# EAGLE design webcam_with_pan_tilt (EAGLE 9.2.2)
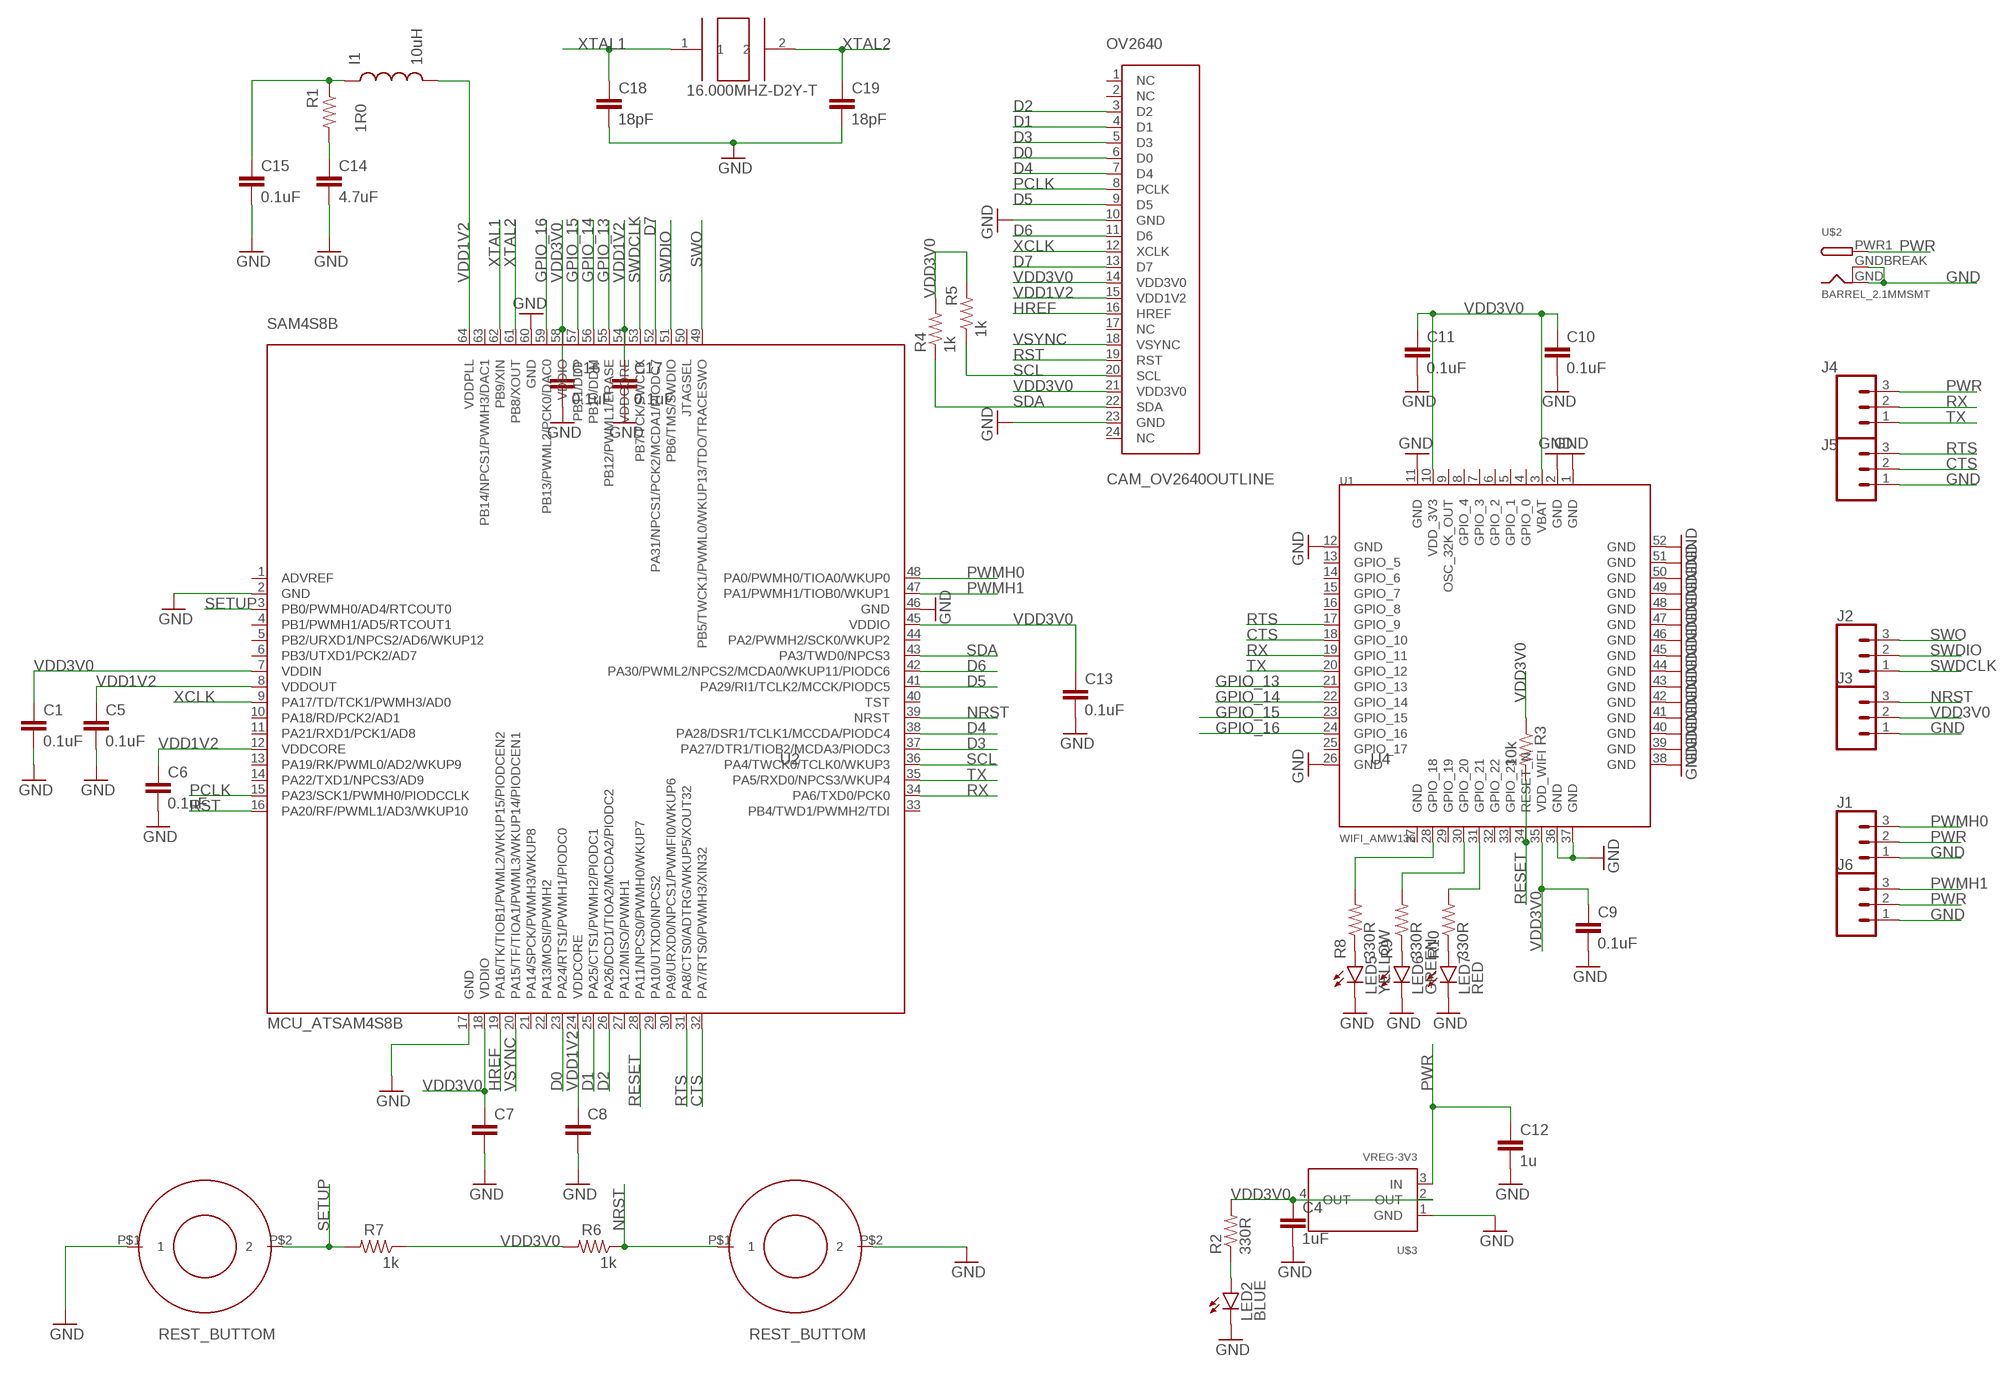
[diagram p0: schematic, sheet 1]

## Parts
16.000MHZ-D2Y-T  XTAL_12MHZ  [ABM7-16.000MHZ-D2Y-T]
C1  0.1uF  CAP  [0805]
C4  1uF  CAP  [0805]
C5  0.1uF  CAP  [0805]
C6  0.1uF  CAP  [0805]
C7  CAP  [0805]
C8  CAP  [0805]
C9  0.1uF  CAP  [0805]
C10  0.1uF  CAP  [0805]
C11  0.1uF  CAP  [0805]
C12  1u  CAP  [0805]
C13  0.1uF  CAP  [0805]
C14  4.7uF  CAP  [0805]
C15  0.1uF  CAP  [0805]
C16  0.1uF  CAP  [0805]
C17  0.1uF  CAP  [0805]
C18  18pF  CAP  [0805]
C19  18pF  CAP  [0805]
I1  10uH  IND  [0805]
J1  CONN_03  [1X03]
J2  CONN_03  [1X03]
J3  CONN_03  [1X03]
J4  CONN_03  [1X03]
J5  CONN_03  [1X03]
J6  CONN_03  [1X03]
LED2  BLUE  LED0603  [LED-0603]
LED5  YELLOW  LED0603  [LED-0603]
LED6  GREEN  LED0603  [LED-0603]
LED7  RED  LED0603  [LED-0603]
OV2640  CAM_OV2640OUTLINE  [CAM_CONN]
R1  1R0  RES  [0805]
R2  330R  RES  [0805]
R3  10k  RES  [0805]
R4  1k  RES  [0805]
R5  1k  RES  [0805]
R6  1k  RES  [0805]
R7  1k  RES  [0805]
R8  330R  RES  [0805]
R9  330R  RES  [0805]
R10  330R  RES  [0805]
SAM4S8B  MCU_ATSAM4S8B  [QFP50P1200X1200X160-64N]
U1  WIFI_AMW136  [AMW136]
U2  REST_BUTTOM  SWITCH_BTN_NO  [BTN_2]
U4  REST_BUTTOM  SWITCH_BTN_NO  [BTN_2]
U$2  BARREL_2.1MMSMT  [DCJACK_2MM_SMT]
U$3  VREG-3V3  [R-PDSO-G4_TI]

## Nets
CTS: J5.2 SAM4S8B.32(PA7/RTS0/PWMH3/XIN32) U1.18(GPIO_10)
D0: OV2640.6(D0) SAM4S8B.23(PA24/RTS1/PWMH1/PIODC0)
D1: OV2640.4(D1) SAM4S8B.25(PA25/CTS1/PWMH2/PIODC1)
D2: OV2640.3(D2) SAM4S8B.26(PA26/DCD1/TIOA2/MCDA2/PIODC2)
D3: OV2640.5(D3) SAM4S8B.37(PA27/DTR1/TIOB2/MCDA3/PIODC3)
D4: OV2640.7(D4) SAM4S8B.38(PA28/DSR1/TCLK1/MCCDA/PIODC4)
D5: OV2640.9(D5) SAM4S8B.41(PA29/RI1/TCLK2/MCCK/PIODC5)
D6: OV2640.11(D6) SAM4S8B.42(PA30/PWML2/NPCS2/MCDA0/WKUP11/PIODC6)
D7: OV2640.13(D7) SAM4S8B.52(PA31/NPCS1/PCK2/MCDA1/PIODC7)
GND: C1.2 C4.2 C5.2 C6.2 C7.2 C8.2 C9.2 C10.2 C11.2 C12.2 C13.2 C14.2 C15.2 C16.2 C17.2 C18.2 C19.2 J1.1 J3.1 J5.1 J6.1 LED2.C LED5.C LED6.C LED7.C OV2640.10(GND) OV2640.23(GND) SAM4S8B.2(GND) SAM4S8B.17(GND) SAM4S8B.46(GND) SAM4S8B.60(GND) U1.1(GND) U1.2(GND) U1.11(GND) U1.12(GND) U1.26(GND) U1.36(GND) U1.37(GND) U1.38(GND) U1.39(GND) U1.40(GND) U1.41(GND) U1.42(GND) U1.43(GND) U1.44(GND) U1.45(GND) U1.46(GND) U1.47(GND) U1.48(GND) U1.49(GND) U1.50(GND) U1.51(GND) U1.52(GND) U2.P$1 U4.P$2 U$2.GND U$2.GNDBREAK U$3.1(GND)
GPIO_13: SAM4S8B.55(PB12/PWML1/ERASE) U1.21(GPIO_13)
GPIO_14: SAM4S8B.56(PB10/DDM) U1.22(GPIO_14)
GPIO_15: SAM4S8B.57(PB11/DDP) U1.23(GPIO_15)
GPIO_16: SAM4S8B.59(PB13/PWML2/PCK0/DAC0) U1.24(GPIO_16)
HREF: OV2640.16(HREF) SAM4S8B.19(PA16/TK/TIOB1/PWML2/WKUP15/PIODCEN2)
N$2: C14.1 R1.2
N$3: C15.1 I1.1 R1.1
N$4: LED5.A R8.1
N$5: LED6.A R9.1
N$6: R8.2 U1.28(GPIO_18)
N$7: LED2.A R2.1
N$8: LED7.A R10.1
N$10: R9.2 U1.30(GPIO_20)
N$12: R10.2 U1.31(GPIO_21)
NRST: J3.3 R6.1 SAM4S8B.39(NRST) U4.P$1
PCLK: OV2640.8(PCLK) SAM4S8B.15(PA23/SCK1/PWMH0/PIODCCLK)
PWMH0: J1.3 SAM4S8B.48(PA0/PWMH0/TIOA0/WKUP0)
PWMH1: J6.3 SAM4S8B.47(PA1/PWMH1/TIOB0/WKUP1)
PWR: C12.1 J1.2 J4.3 J6.2 U$2.PWR1(PWR) U$3.3(IN)
RESET: R3.2 SAM4S8B.28(PA11/NPCS0/PWMH0/WKUP7) U1.34(RESET_N)
RST: OV2640.19(RST) SAM4S8B.16(PA20/RF/PWML1/AD3/WKUP10)
RTS: J5.3 SAM4S8B.31(PA8/CTS0/ADTRG/WKUP5/XOUT32) U1.17(GPIO_9)
RX: J4.2 SAM4S8B.34(PA6/TXD0/PCK0) U1.19(GPIO_11)
SCL: OV2640.20(SCL) R5.1 SAM4S8B.36(PA4/TWCK0/TCLK0/WKUP3)
SDA: OV2640.22(SDA) R4.1 SAM4S8B.43(PA3/TWD0/NPCS3)
SETUP: R7.2 SAM4S8B.3(PB0/PWMH0/AD4/RTCOUT0) U2.P$2
SWDCLK: J2.1 SAM4S8B.53(PB7/TCK/SWCLK)
SWDIO: J2.2 SAM4S8B.51(PB6/TMS/SWDIO)
SWO: J2.3 SAM4S8B.49(PB5/TWCK1/PWML0/WKUP13/TDO/TRACESWO)
TX: J4.1 SAM4S8B.35(PA5/RXD0/NPCS3/WKUP4) U1.20(GPIO_12)
VDD1V2: C5.1 C6.1 C8.1 C17.1 I1.2 OV2640.15(VDD1V2) SAM4S8B.8(VDDOUT) SAM4S8B.12(VDDCORE) SAM4S8B.24(VDDCORE) SAM4S8B.54(VDDCORE) SAM4S8B.64(VDDPLL)
VDD3V0: C1.1 C4.1 C7.1 C9.1 C10.1 C11.1 C13.1 C16.1 J3.2 OV2640.14(VDD3V0) OV2640.21(VDD3V0) R2.2 R3.1 R4.2 R5.2 R6.2 R7.1 SAM4S8B.7(VDDIN) SAM4S8B.18(VDDIO) SAM4S8B.45(VDDIO) SAM4S8B.58(VDDIO) U1.3(VBAT) U1.10(VDD_3V3) U1.35(VDD_WIFI) U$3.2(OUT) U$3.4(OUT)
VSYNC: OV2640.18(VSYNC) SAM4S8B.20(PA15/TF/TIOA1/PWML3/WKUP14/PIODCEN1)
XCLK: OV2640.12(XCLK) SAM4S8B.9(PA17/TD/TCK1/PWMH3/AD0)
XTAL1: 16.000MHZ-D2Y-T.1 C18.1 SAM4S8B.62(PB9/XIN)
XTAL2: 16.000MHZ-D2Y-T.2 C19.1 SAM4S8B.61(PB8/XOUT)
Unconnected: OV2640.1(NC) OV2640.2(NC) OV2640.17(NC) OV2640.24(NC) SAM4S8B.1(ADVREF) SAM4S8B.4(PB1/PWMH1/AD5/RTCOUT1) SAM4S8B.5(PB2/URXD1/NPCS2/AD6/WKUP12) SAM4S8B.6(PB3/UTXD1/PCK2/AD7) SAM4S8B.10(PA18/RD/PCK2/AD1) SAM4S8B.11(PA21/RXD1/PCK1/AD8) SAM4S8B.13(PA19/RK/PWML0/AD2/WKUP9) SAM4S8B.14(PA22/TXD1/NPCS3/AD9) SAM4S8B.21(PA14/SPCK/PWMH3/WKUP8) SAM4S8B.22(PA13/MOSI/PWMH2) SAM4S8B.27(PA12/MISO/PWMH1) SAM4S8B.29(PA10/UTXD0/NPCS2) SAM4S8B.30(PA9/URXD0/NPCS1/PWMFI0/WKUP6) SAM4S8B.33(PB4/TWD1/PWMH2/TDI) SAM4S8B.40(TST) SAM4S8B.44(PA2/PWMH2/SCK0/WKUP2) SAM4S8B.50(JTAGSEL) SAM4S8B.63(PB14/NPCS1/PWMH3/DAC1) U1.4(GPIO_0) U1.5(GPIO_1) U1.6(GPIO_2) U1.7(GPIO_3) U1.8(GPIO_4) U1.9(OSC_32K_OUT) U1.13(GPIO_5) U1.14(GPIO_6) U1.15(GPIO_7) U1.16(GPIO_8) U1.25(GPIO_17) U1.27(GND) U1.29(GPIO_19) U1.32(GPIO_22) U1.33(GPIO_23)

## Library data of the parts
16.000MHZ-D2Y-T = Ilya_Teach:XTAL_12MHZ
C1 C4-C19 = Ilya_Teach:CAP
I1 = Ilya_Teach:IND
J1-J6 = SparkFun-Connectors:CONN_03: Multi connection point. Often used as Generic Header-pin footprint for 0.1 inch spaced/style header connections On any of the 0.1 inch spaced packages, you can populate with these: Break Away Headers - Straight <https://www.sparkfun.com/products/116> (PRT-00116) Break Away Male Headers - Right Angle <https://www.sparkfun.com/products/553> (PRT-00553) Female Headers <https://www.sparkfun.com/products/115> (PRT-00115) Break Away Headers - Machine Pin <https://www.sparkfun.com/products/117> (PRT-00117) Break Away Female Headers - Swiss Machine Pin <https://www.sparkfun.com/products/743> (PRT-00743) Stackable Header - 3 Pin (Female, 0.1") <https://www.sparkfun.com/products/13875> (PRT-13875) For SCREWTERMINALS and SPRING TERMINALS visit here: Screw Terimnals on SparkFun.com <https://www.sparkfun.com/search/results?term=Screw+Terminals> (5mm/3.5mm/2.54mm spacing) This device is also useful as a general connection point to wire up your design to another part of your project. Our various solder wires solder well into these plated through hole pads. Hook-Up Wire - Assortment (Stranded, 22 AWG) <https://www.sparkfun.com/products/11375> (PRT-11375) Hook-Up Wire - Assortment (Solid Core, 22 AWG) <https://www.sparkfun.com/products/11367> (PRT-11367) View the entire wire category on our website here <https://www.sparkfun.com/categories/141> Special notes: Molex polarized connector foot print use with SKU : PRT-08232 with associated crimp pins and housings.
LED2 LED5-LED7 = Ilya_Teach:LED: LEDs Standard schematic elements and footprints for 5mm, 3mm, 1206, and 0603 sized LEDs. 5mm - Spark Fun Electronics SKU : COM-00529 (and others)
OV2640 = Ilya_Teach:CAM_OV2640
R1-R10 = Ilya_Teach:RES
SAM4S8B = Ilya_Teach:MCU_ATSAM4S8B
U1 = Ilya_Teach:WIFI_AMW136
U2 U4 = Ilya_Teach:SWITCH_BTN_NO
U$2 = Ilya_Teach:BARREL_2.1MM
U$3 = Ilya_Teach:VREG-3V3

## Board
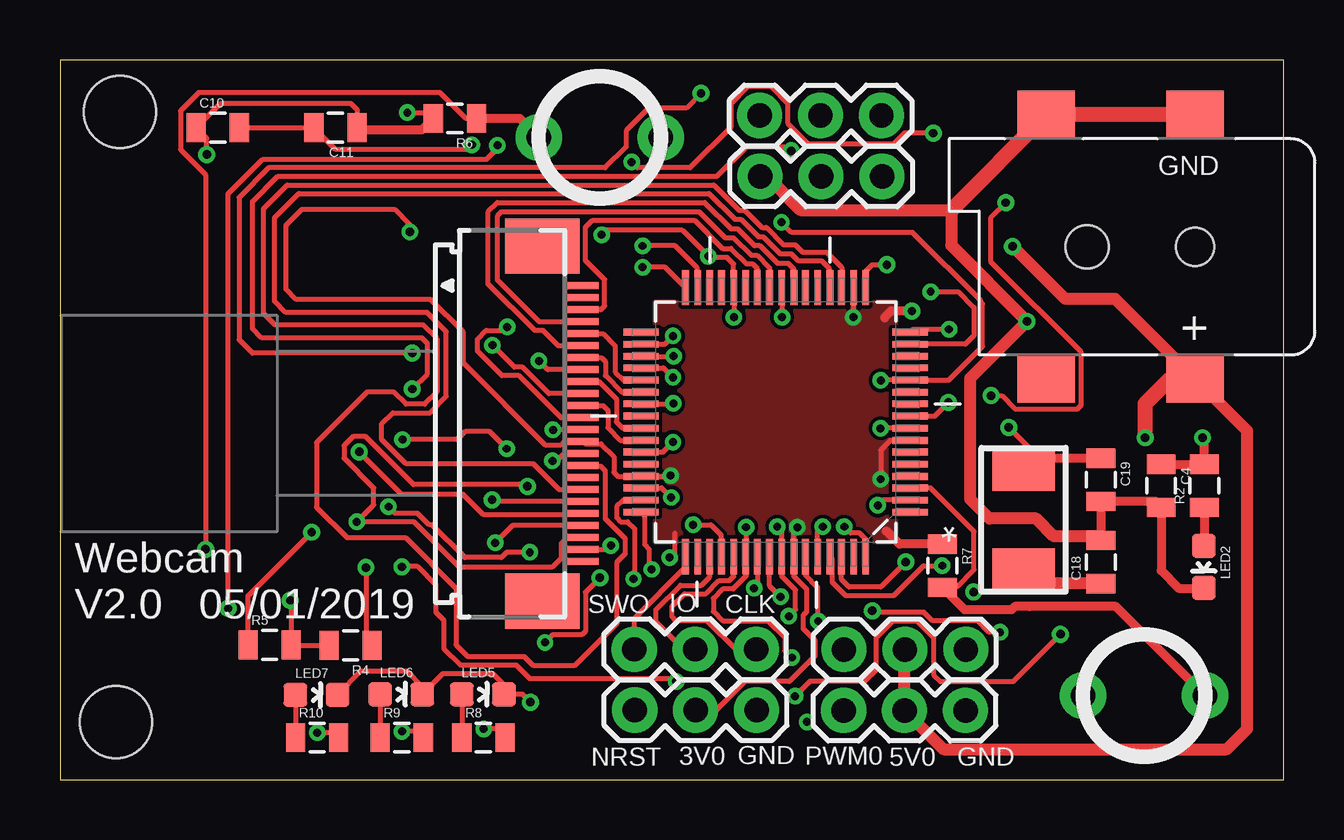
[diagram p1: board, top side]
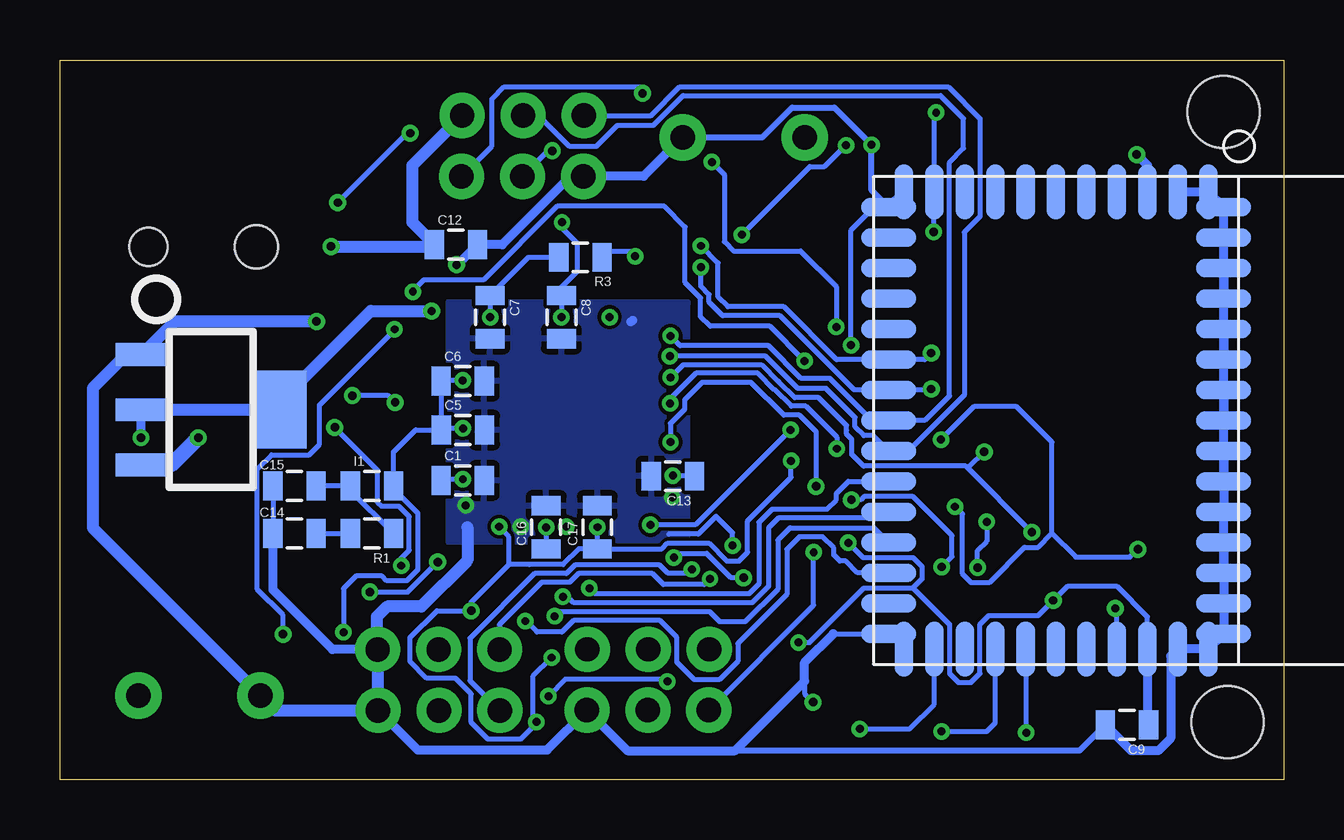
[diagram p2: board, bottom side, seen from below]

Size 51 x 30 mm. Coordinates in mm from the lower left corner, seen from the top.
Outline: 0,0 51,0 51,30 0,30 0,0
Copper layers (1*16): Top 0.0356mm / dielectric 1.5011mm / Bottom 0.0356mm
Design rules "LaenPCBOrder": minimum track width 6mil, minimum drill 13mil, track to track 6mil, track to pad 6mil, pad to pad 6mil, via to via 6mil, smd to smd 6mil, copper to edge 15mil, drill to drill 6mil, minimum pad ring 7mil, minimum via ring 7mil, stop-mask expansion 3mil, vias tented up to drill 0mil, thermal gap 10mil
Holes 3 mm at 2.5,27.83 2.34,2.39

### Footprints (pad centres in the part's own frame; a part is rotated, then mirrored left to right if it is on the bottom)
ABM7-16.000MHZ-D2Y-T = smd 1.9 x 2.6: 1 -2.15,0; 2 2.15,0
0805 = smd 0.8 x 1.2: 1 -0.9,0; 2 0.9,0
1X03 = drill 1.016 pad 1.88: 1 0,0; 2 2.54,0; 3 5.08,0
LED-0603 = smd 1 x 1: A 0,-0.877; C 0,0.877
CAM_CONN = smd 0.3 x 1.3: 1 -5.75,3.25; 2 -5.25,3.25; 3 -4.75,3.25; 4 -4.25,3.25; 5 -3.75,3.25; 6 -3.25,3.25; 7 -2.75,3.25; 8 -2.25,3.25; 9 -1.75,3.25; 10 -1.25,3.25; 11 -0.75,3.25; 12 -0.25,3.25; 13 0.25,3.25; 14 0.75,3.25; 15 1.25,3.25; 16 1.75,3.25; 17 2.25,3.25; 18 2.75,3.25; 19 3.25,3.25; 20 3.75,3.25; 21 4.25,3.25; 22 4.75,3.25; 23 5.25,3.25; 24 5.75,3.25 | smd 2.3 x 3.1: P1 -7.4,1.55; P2 7.4,1.55
QFP50P1200X1200X160-64N = smd 1.473 x 0.279: 1 -5.613,3.759; 2 -5.613,3.251; 3 -5.613,2.743; 4 -5.613,2.261; 5 -5.613,1.753; 6 -5.613,1.245; 7 -5.613,0.762; 8 -5.613,0.254; 9 -5.613,-0.254; 10 -5.613,-0.762; 11 -5.613,-1.245; 12 -5.613,-1.753; 13 -5.613,-2.261; 14 -5.613,-2.743; 15 -5.613,-3.251; 16 -5.613,-3.759; 33 5.613,-3.759; 34 5.613,-3.251; 35 5.613,-2.743; 36 5.613,-2.261; 37 5.613,-1.753; 38 5.613,-1.245; 39 5.613,-0.762; 40 5.613,-0.254; 41 5.613,0.254; 42 5.613,0.762; 43 5.613,1.245; 44 5.613,1.753; 45 5.613,2.261; 46 5.613,2.743; 47 5.613,3.251; 48 5.613,3.759 | smd 0.279 x 1.473: 17 -3.759,-5.613; 18 -3.251,-5.613; 19 -2.743,-5.613; 20 -2.261,-5.613; 21 -1.753,-5.613; 22 -1.245,-5.613; 23 -0.762,-5.613; 24 -0.254,-5.613; 25 0.254,-5.613; 26 0.762,-5.613; 27 1.245,-5.613; 28 1.753,-5.613; 29 2.261,-5.613; 30 2.743,-5.613; 31 3.251,-5.613; 32 3.759,-5.613; 49 3.759,5.613; 50 3.251,5.613; 51 2.743,5.613; 52 2.261,5.613; 53 1.753,5.613; 54 1.245,5.613; 55 0.762,5.613; 56 0.254,5.613; 57 -0.254,5.613; 58 -0.762,5.613; 59 -1.245,5.613; 60 -1.753,5.613; 61 -2.261,5.613; 62 -2.743,5.613; 63 -3.251,5.613; 64 -3.759,5.613
AMW136 = smd 0.762 x 2.286: 1 6.35,9.525; 2 5.08,9.525; 3 3.81,9.525; 4 2.54,9.525; 5 1.27,9.525; 6 0,9.525; 7 -1.27,9.525; 8 -2.54,9.525; 9 -3.81,9.525; 10 -5.08,9.525; 11 -6.35,9.525; 27 -6.35,-9.525; 28 -5.08,-9.525; 29 -3.81,-9.525; 30 -2.54,-9.525; 31 -1.27,-9.525; 32 0,-9.525; 33 1.27,-9.525; 34 2.54,-9.525; 35 3.81,-9.525; 36 5.08,-9.525; 37 6.35,-9.525 | smd 2.286 x 0.762: 12 -6.985,8.89; 13 -6.985,7.62; 14 -6.985,6.35; 15 -6.985,5.08; 16 -6.985,3.81; 17 -6.985,2.54; 18 -6.985,1.27; 19 -6.985,0; 20 -6.985,-1.27; 21 -6.985,-2.54; 22 -6.985,-3.81; 23 -6.985,-5.08; 24 -6.985,-6.35; 25 -6.985,-7.62; 26 -6.985,-8.89; 38 6.985,-8.89; 39 6.985,-7.62; 40 6.985,-6.35; 41 6.985,-5.08; 42 6.985,-3.81; 43 6.985,-2.54; 44 6.985,-1.27; 45 6.985,0; 46 6.985,1.27; 47 6.985,2.54; 48 6.985,3.81; 49 6.985,5.08; 50 6.985,6.35; 51 6.985,7.62; 52 6.985,8.89
BTN_2 = drill 1.016 pad 1.93: P$1 -2.54,0; P$2 2.54,0
DCJACK_2MM_SMT = smd 2.4 x 2: GND -2.54,-5.5; GNDBREAK 3.66,-5.5; PWR1 -2.54,5.5; PWR2 3.66,5.5 | hole 1.6: -2.54,0 | hole 1.8: 1.96,0
R-PDSO-G4_TI = smd 0.95 x 2.15: 1 -2.3,-2.9; 2 0,-2.9; 3 2.3,-2.9 | smd 3.25 x 2.15: 4 0,2.9

### Placement (x,y rotation side)
16.000MHZ-D2Y-T  40.16,10.83 90 top
C1  34.21,12.47 0 bottom
C4  45.9,12.24 270 top
C5  34.21,14.57 0 bottom
C6  34.21,16.61 0 bottom
C7  33.07,19.28 270 bottom
C8  30.1,19.28 270 bottom
C9  6.53,2.29 180 bottom
C10  6.58,27.18 0 top
C11  11.48,27.18 180 top
C12  34.49,22.3 0 bottom
C13  25.45,12.65 180 bottom
C14  41.22,10.26 180 bottom
C15  41.22,12.24 180 bottom
C16  30.73,10.52 90 bottom
C17  28.6,10.52 90 bottom
C18  43.38,9.07 90 top
C19  43.38,12.5 270 top
I1  38,12.24 0 bottom
J1  37.75,2.88 180 top
J2  29.02,5.43 180 top
J3  29.04,2.89 180 top
J4  29.16,27.69 0 top
J5  29.18,25.15 0 top
J6  37.76,5.42 180 top
LED2  47.68,8.86 180 top
LED5  17.63,3.56 270 top
LED6  14.22,3.56 270 top
LED7  10.69,3.53 270 top
OV2640  18.55,14.84 270 top
R1  38,10.26 180 bottom
R2  47.7,12.24 90 top
R3  29.31,21.77 0 bottom
R4  12.12,5.59 180 top
R5  8.74,5.61 0 top
R6  16.46,27.56 180 top
R7  36.78,8.92 270 top
R8  17.65,1.75 0 top
R9  14.25,1.75 0 top
R10  10.72,1.75 0 top
SAM4S8B  29.83,14.9 180 top
U1  9.48,14.97 0 bottom
U2  45.19,3.51 0 top
U4  22.5,26.77 0 top
U$2  44.77,22.21 180 top
U$3  44.69,15.42 270 bottom

### Tracks (layer width: path | path; a pad name or v marks a point on that pad's centre or on a via)
CTS  (via drill 0.33, 0.35)
  Top 0.203: SAM4S8B.32 25.22,21.36 v24.28,21.36 | v30.48,26.21 30.3,26.39 28.63,26.39 27.38,25.15 9.07,25.15 8.03,24.1 8.03,18.8 8.41,18.41 15.09,18.41 15.32,18.19 15.32,16.92 v14.68,16.28
  Bottom 0.203: J5.2 30.57,26.3 v30.48,26.21 | v14.68,16.28 14.72,16.24 U1.18 17.89,16.24 20.99,19.34 23.38,19.34 23.94,19.9 23.94,20.23 24.28,20.57 v24.28,21.36
D0
  Top 0.203: SAM4S8B.23 30.59,21.28 30.34,21.53 29.91,21.53 29.18,22.25 28.96,22.25 28.25,22.96 27.96,22.96 26.87,24.05 18.24,24.05 17.83,23.65 17.83,20.68 19.77,18.73 20.12,18.73 20.76,18.09 OV2640.6
D1
  Top 0.203: SAM4S8B.25 29.58,21.33 29.04,21.86 28.81,21.86 28.08,22.59 27.72,22.59 26.64,23.67 18.41,23.67 18.22,23.48 18.22,20.84 19.98,19.09 OV2640.4
D2
  Top 0.203: SAM4S8B.26 29.07,21.3 28.86,21.5 28.61,21.5 27.98,22.14 27.62,22.14 26.44,23.32 22.2,23.32 21.9,23.02 21.9,21.64 22.7,20.84 22.7,19.74 22.55,19.58 OV2640.3
D3
  Top 0.203: OV2640.5 22.63,18.59 23.14,18.08 23.14,16.99 23.48,16.65 SAM4S8B.37
D4
  Top 0.203: OV2640.7 22.57,17.59 22.73,17.42 22.73,16.84 23.43,16.14 SAM4S8B.38
D5
  Top 0.203: OV2640.9 22.48,16.59 23.19,15.88 23.19,14.91 23.45,14.65 SAM4S8B.41
D6
  Top 0.203: OV2640.11 22.64,15.59 22.84,15.39 22.84,14.66 23.35,14.14 SAM4S8B.42
D7  (via drill 0.33)
  Top 0.203: OV2640.13 v20.55,14.58 | v26.39,10.62 27.13,10.62 27.56,10.19 27.56,9.3 SAM4S8B.52
  Bottom 0.203: v20.55,14.58 24.51,10.62 v26.39,10.62
GND  (via drill 0.33, 0.35)
  Top 0.203: SAM4S8B.2 34.31,11.65 v34.09,11.43 | SAM4S8B.17 33.59,21.19 33.86,21.46 v34.47,21.46 | C10.2 C11.2 11.5,26.26 17.17,26.26 v17.17,26.46 | SAM4S8B.60 31.58,10.32 v31.8,10.54 | SAM4S8B.46 25.08,12.16 v25.48,11.76 | OV2640.23 22.8,9.59 v22.96,9.75 | LED7.C 12.56,4.52 14.45,4.52 15.1,3.87 LED6.C 15.96,4.42 18.03,4.42 18.5,3.95 LED5.C 19.28,3.56 v19.61,3.23 | OV2640.10 20.38,16.09 19.27,17.2 18.94,17.2 v18.03,18.11
  Top 0.381: C18.2 C19.2 45.64,11.6 C4.2 45.9,8.71 46.63,7.98 47.66,7.98 LED2.C
  Top 0.508: J5.1 29.46,25.15 30.86,23.75 37.15,23.75 37.15,22.26 v40.31,19.1 37.95,16.74 37.95,11.68 38.75,10.88 40.69,10.88 41.43,10.15 43.2,10.15 C18.2
  Top 0.635: U$2.GND U$2.GNDBREAK 37.15,23.75
  Bottom 0.203: C15.2 C14.2 | 19.96,4.1 19.96,3.58 v19.61,3.23 | v18.03,18.11 18.03,22.9 17.1,23.84 | v22.96,9.75 22.96,10.29 23.65,10.97 24.39,10.24 25.63,10.24 | 18.76,6.08 U1.26
  Bottom 0.254: C9.2 8.51,1.21 22.89,1.21 | U1.12 17.17,24.57 v17.17,26.46 18.72,28.02 20.48,28.02 21.73,26.77 U4.P$2
  Bottom 0.381: 18.76,6.08 19.96,4.88 19.96,4.1 22.86,1.21 22.89,1.21 27.35,1.21 J3.1 30.69,1.24 36.09,1.24 37.73,2.88 J1.1 | U1.40 U1.42 U1.43 | U1.43 U1.45 | U1.45 U1.47 | U1.47 U1.49 | U1.49 U1.51 U1.52 U1.1 U1.2 | C9.2 6.35,1.21 5.22,1.21 4.71,1.72 4.71,5.14 U1.36 U1.37 U1.38 U1.39 U1.40 | J6.1 39.64,5.42 42.12,7.91 C14.2 | U1.41 U1.40 | U1.44 U1.43 | U1.46 U1.45 | U1.48 U1.47 | U1.50 U1.49 | U1.11 U1.12 | v34.47,21.46 34.43,21.46 C12.2 32.56,22.3 29.72,25.15 J5.1 26.67,25.15 U4.P$2 | 27.13,19.15 27.2,19.07
  Bottom 0.508: v40.31,19.1 46.21,19.1 U$3.1 48.23,17.72 49.63,16.32 49.63,10.49 U2.P$1 42.02,2.88 J1.1 37.76,5.05 | J6.1 37.76,5.05 | U1.12 16.49,23.84 17.1,23.84 | 34.01,10.52 34.01,9.14 35.94,7.21 37.36,7.21 37.8,6.78 37.8,5.09 37.76,5.05
  pour Bottom: 24.82,19.91 34.82,19.91 34.82,9.91 24.82,9.91 24.82,19.84 24.84,19.84
GPIO_13  (via drill 0.33)
  Top 0.203: SAM4S8B.55 29.07,8.11 v28.93,7.97
  Bottom 0.203: v28.93,7.97 28.7,7.74 22.28,7.74 21.87,8.15 21.87,10.72 21.31,11.28 19.02,11.28 18.64,11.66 18.64,11.93 18.14,12.43 U1.21
GPIO_14  (via drill 0.33)
  Top 0.203: v30.04,7.62 29.58,8.08 SAM4S8B.56
  Bottom 0.203: U1.22 16.73,10.9 21.06,10.9 21.46,10.49 21.46,8.06 22.15,7.37 29.59,7.37 29.85,7.62 v30.04,7.62
GPIO_15  (via drill 0.33)
  Top 0.203: v29.9,10.54 30.08,10.35 SAM4S8B.57 30.08,8.47 30.66,7.9 30.66,7.09 v30.38,6.81
  Bottom 0.203: U1.23 17.07,10.5 20.57,10.5 21.08,9.98 21.08,7.93 22.44,6.58 23.5,6.58 23.93,7.01 30.18,7.01 v30.38,6.81
GPIO_16  (via drill 0.33)
  Top 0.203: v31.61,6.6 31.58,6.63 31.58,8.02 31.07,8.52 SAM4S8B.59
  Bottom 0.203: U1.24 17.75,8.62 18.24,9.11 18.49,9.11 18.75,9.36 18.75,9.65 19.21,10.12 20.18,10.12 20.7,9.6 20.7,7.72 22.75,5.68 22.75,4.93 23.51,4.17 24.56,4.17 25.29,4.89 25.29,5.92 25.99,6.63 29.59,6.63 30.07,6.15 31.11,6.15 31.57,6.6 v31.61,6.6
HREF
  Top 0.203: SAM4S8B.19 32.59,20.53 32.59,21.34 31.96,21.97 30.97,21.97 30.65,22.29 30.16,22.29 29.44,23.01 29.26,23.01 28.55,23.72 28.32,23.72 27.25,24.79 9.47,24.79 8.48,23.8 8.48,19.43 8.96,18.95 15.14,18.95 15.71,18.38 15.71,16.15 15.21,15.65 14.42,15.65 13.91,16.15 12.8,16.15 10.69,14.05 10.69,11.35 11.96,10.08 14.4,10.08 16.51,7.97 16.51,5.62 16.99,5.13 19.35,5.13 19.71,4.77 21.48,4.77 23.23,6.52 23.23,9.08 23.57,9.42 23.57,10.03 22.73,10.88 22.73,12.87 22.53,13.07 21.82,13.07 OV2640.16
N$2
  Bottom 0.203: C14.1 R1.2
N$3
  Bottom 0.203: C15.1 I1.1 38.9,12.06 R1.1
N$4
  Top 0.203: LED5.A R8.1
N$5
  Top 0.203: LED6.A R9.1
N$6  (via drill 0.33)
  Top 0.203: R8.2 18.2,2.11 v17.66,2.11
  Bottom 0.203: v17.66,2.11 15.6,2.11 14.56,3.14 U1.28
N$7
  Top 0.381: R2.1 47.7,9.77 LED2.A
N$8
  Top 0.203: LED7.A R10.1
N$10  (via drill 0.33)
  Top 0.203: R9.2 14.89,2.01 v14.26,2.01
  Bottom 0.203: v14.26,2.01 12.37,2.01 12.02,2.36 U1.30
N$12  (via drill 0.33)
  Top 0.203: R10.2 11.42,1.96 v10.72,1.96
  Bottom 0.203: v10.72,1.96 10.72,5.42 U1.31
NRST  (via drill 0.33, 0.35)
  Top 0.203: SAM4S8B.39 25.55,15.66 v25.57,15.68 | v19.58,9.47 18.62,9.47 18.4,9.26 16.88,9.26 15.52,10.62 15.39,10.62 14.9,11.1 13.97,11.1 v13.69,11.38 | v18.62,13.79 17.91,14.5 16.89,14.5 16.56,14.17 v14.28,14.17 | R6.1 16.92,27.56 15.84,28.64 5.78,28.64 5.03,27.88 5.03,26.26 6.07,25.22 v6.07,9.6
  Top 0.381: U4.P$1 19.18,27.56 R6.1
  Bottom 0.203: v18.62,13.79 18.62,14.28 19.91,15.57 20.52,15.57 21.19,16.24 21.22,16.24 21.91,16.94 24.49,16.94 25.57,15.86 v25.57,15.68 | J3.3 19.58,7.27 v19.58,9.47 | v13.69,11.38 13.38,11.07 13.38,8.58 13.01,8.21 12.27,8.21 10.79,9.68 10.23,9.68 9.65,10.26 | 9.65,10.26 9.65,14.07 11.12,15.54 12.9,15.54 v14.28,14.17 | v6.07,9.6 6.4,9.27 8.67,9.27 9.65,10.26
PCLK  (via drill 0.33)
  Top 0.203: OV2640.8 20.32,17.09 v19.96,17.45 | v36.29,20.34 37.45,20.34 38.1,19.68 38.1,18.52 37.73,18.15 SAM4S8B.15
  Bottom 0.203: v19.96,17.45 21.41,18.9 23.9,18.9 24.3,19.29 24.3,20.08 24.94,20.73 24.94,23.04 25.81,23.9 30.28,23.9 33.35,20.83 35.84,20.83 36.29,20.38 v36.29,20.34
PWMH0  (via drill 0.33)
  Top 0.203: SAM4S8B.48 24.37,10.99 24.37,9.79 24.56,9.6 24.56,8.86 v24.66,8.76
  Bottom 0.203: J1.3 33.91,4.12 33.91,5.89 31.22,8.59 29.9,8.59 29.54,8.94 26.01,8.94 25.69,8.62 24.81,8.62 v24.66,8.76
PWMH1  (via drill 0.33)
  Top 0.203: SAM4S8B.47 24.2,11.64 23.46,11.64 23.2,11.38 23.2,10.92 23.38,10.75 23.66,10.75 23.95,10.46 23.95,8.41 v23.91,8.36
  Bottom 0.203: J6.3 32.68,6.46 30.92,8.22 29.75,8.22 29.39,8.59 26.3,8.59 25.85,8.13 24.14,8.13 v23.91,8.36
PWR  (via drill 0.35)
  Top 0.508: 46.28,16.71 U$2.PWR1 | U$2.PWR1 43.98,20.04 41.91,20.04 39.73,22.23 v39.7,22.23 | J6.2 35.21,5.41 J1.2 36.81,1.27 48.64,1.27 49.48,2.11 49.48,14.54 U$2.PWR1
  Top 0.635: v45.24,14.25 45.24,15.67 46.28,16.71
  Bottom 0.508: J4.3 36.32,25.6 36.32,23.23 C12.1 35.47,22.23 v39.7,22.23
  Bottom 0.635: U$3.3 46.37,13.12 v45.24,14.25
RESET  (via drill 0.33, 0.35)
  Top 0.152: SAM4S8B.28 28.09,20.5
  Top 0.203: 28.09,20.5 v28.09,19.28 | SAM4S8B.28 28.08,21.5 27.81,21.77 27.08,21.77 v27.03,21.82 25.94,22.9 22.77,22.9 v22.58,22.71 | v7.01,7.14 7.01,24.42 8.45,25.86 17.78,25.86 18.24,26.31 v18.24,26.44
  Bottom 0.152: 28.17,22.01 R3.2
  Bottom 0.203: v27.03,21.82 27.22,22.01 28.17,22.01 | U1.34 6.94,7.07 v7.01,7.14 | v22.58,22.71 19.74,25.55 19.13,25.55 v18.24,26.44
RST  (via drill 0.33, 0.35)
  Top 0.203: OV2640.19 18.09,11.59 v18.01,11.66 | v14.25,8.87 14.27,8.88 14.91,8.88 15.67,8.12 15.67,6.99 16,6.66 16,5.47 16.69,4.78 19.01,4.78 19.57,4.22 25.68,4.22 v25.68,4.09 | v41.71,6.06 39.74,4.09 36.7,4.09 36.41,4.37 36.41,5.92 35.71,6.62 34.72,6.62 34.02,5.92 34.02,4.57 33.56,4.11 31.27,4.11 v30.64,3.48 | v37.06,18.77 35.55,18.77 SAM4S8B.16
  Bottom 0.203: v14.25,8.87 13.82,9.3 13.82,10.17 15.44,11.79 17.49,11.79 17.62,11.66 v18.01,11.66 | v25.68,4.09 25.68,4.19 29.93,4.19 v30.64,3.48 | v41.71,6.06 41.71,6.86 42.78,7.94 42.78,12.95 42.19,13.54 40.61,13.54 40.18,13.97 40.18,15.62 37.06,18.75 v37.06,18.77
RTS  (via drill 0.33, 0.35)
  Top 0.203: SAM4S8B.31 26.57,20.53 26.57,21.32 25.64,22.25 v24.28,22.25 | v26.72,28.61 26.11,27.99 24.54,27.99 23.6,27.05 23.6,26.37 22.73,25.5 8.7,25.5 7.47,24.27 7.47,18.34 8.03,17.78 v14.68,17.78
  Bottom 0.203: J5.3 32.99,26.42 32.99,28.37 32.49,28.88 26.82,28.88 26.82,28.71 v26.72,28.61 | v14.68,17.78 14.95,17.51 U1.17 18.63,17.51 20.83,19.71 23.16,19.71 23.57,20.12 23.57,21.54 v24.28,22.25
RX  (via drill 0.33)
  Top 0.203: SAM4S8B.34 25.21,18.15 v25.55,18.49
  Bottom 0.203: J4.2 31.05,27.69 29.75,26.39 28.65,26.39 27.78,27.27 26.27,27.27 25.02,28.52 14.29,28.52 13.34,27.56 13.34,26.31 13.93,25.72 13.93,16 14.95,14.97 U1.19 17.15,14.97 18.91,16.73 20.11,16.73 21.46,18.09 25.15,18.09 v25.55,18.49
SCL  (via drill 0.33, 0.35)
  Top 0.203: SAM4S8B.36 25.16,17.16 v25.55,16.76 | R5.1 7.84,7.66 v10.49,10.31 | v12.47,13.66 14.25,11.89 16.81,11.89 17.66,11.03 21.74,11.03 OV2640.20
  Bottom 0.203: v10.49,10.31 13.21,13.03 | 13.21,13.03 13.24,13.06 17.51,13.06 18,13.55 18,14.19 18.21,14.4 18.21,14.55 18.22,14.56 18.22,14.76 19.38,15.93 20.37,15.93 21.04,16.6 21.07,16.6 21.77,17.3 25.02,17.3 v25.55,16.76 | v12.47,13.66 13.11,13.03 13.21,13.03
SDA  (via drill 0.33, 0.35)
  Top 0.203: SAM4S8B.43 25.14,13.65 v25.55,14.07 | OV2640.22 21.15,10.1 20.9,9.85 20.9,9.25 20.52,8.87 16.63,8.87 14.76,10.74 v12.37,10.74 13.08,11.46 13.08,12.16 11.84,13.4 11.84,13.93 12.21,14.3 12.73,14.3 14.73,12.3 19.41,12.3 v19.48,12.22 | v12.75,8.84 12.75,5.85 R4.1
  Bottom 0.203: v12.37,10.74 12.37,9.93 12.75,9.55 v12.75,8.84 | v19.48,12.22 19.48,14.5 20.17,15.19 20.83,15.19 22.2,16.56 24.23,16.56 24.97,15.82 24.97,15.43 25.55,14.85 v25.55,14.07
SETUP
  Top 0.203: R7.2 37.36,8.02 38.1,8.75 38.1,10.34 36.28,12.16 SAM4S8B.3
  Top 0.381: R7.2 37.71,7.09 39.67,7.09 39.8,7.21 40.41,7.21 44.02,7.21 U2.P$2
SWDCLK
  Top 0.203: SAM4S8B.53 28.08,8.47 27.91,8.3 27.47,8.3 26.92,7.75 26.04,7.75 25.5,7.21 25.5,6.81 25.69,6.62 26.97,6.62 28.17,5.43 J2.1
SWDIO
  Top 0.203: SAM4S8B.51 27.09,8.46 26.73,8.1 25.86,8.1 24.84,7.09 24.84,6.58 25.99,5.43 J2.2
SWO
  Top 0.203: J2.3 23.94,6.72 26.07,8.86 SAM4S8B.49
TX  (via drill 0.33)
  Top 0.203: SAM4S8B.35 25.57,17.64 v25.57,17.65
  Bottom 0.203: v25.57,17.65 21.59,17.65 20.24,16.31 19.07,16.31 17.86,15.1 17.86,14.71 17.49,14.34 17.1,14.34 U1.20 15.64,13.7 13.31,16.03 13.31,22.82 12.65,23.47 12.65,27.56 13.97,28.88 25.17,28.88 26.36,27.69 J4.1
VDD1V2  (via drill 0.33, 0.35)
  Top 0.152: 34.22,16.65 v34.21,16.64
  Top 0.203: 34.22,16.65 SAM4S8B.12 37.05,16.65 38.46,18.06 38.46,19.83 38.38,19.91 38.38,19.96 35.53,22.81 30.5,22.81 v30.07,23.23 | SAM4S8B.24 30.08,19.29 v30.1,19.28 | v28.6,10.52 28.6,9.3 SAM4S8B.54 28.6,9.27 28.6,8.49 28.05,7.94 27.62,7.94 27.24,7.56 27.24,7 27.62,6.62 29.51,6.62 30.21,5.92 30.21,5.37 v30.5,5.08 | v39.18,6.14 38.73,6.14 38.25,6.62 36.37,6.62 36.01,6.97 33.92,6.97 v33.86,7.04 | v32.69,10.54 32.95,10.28 33.33,10.28 33.59,10.01 SAM4S8B.64 | OV2640.15 21,13.59 20.7,13.29 v20.52,13.29 | SAM4S8B.8 v34.21,14.65 v34.2,14.64
  Bottom 0.152: 35.09,16.64 C6.1
  Bottom 0.203: v34.21,16.64 35.09,16.64 | v30.1,19.28 C8.1 30.1,20.52 29.43,21.19 29.43,22.35 30.07,22.99 v30.07,23.23 | C17.1 v28.6,10.52 | v30.5,5.08 31.29,4.29 31.29,2.55 v31.14,2.4 31.14,2.35 31.81,1.68 33.16,1.68 33.86,2.38 33.86,3.57 34.52,4.23 35.71,4.23 36.41,4.93 36.41,5.92 35.29,7.04 v33.86,7.04 33.86,7.39 32.28,8.97 | v39.18,6.14 39.18,7.96 38.66,8.48 37.58,8.48 37.38,8.28 36.55,8.28 36.09,8.74 36.09,11.11 37.1,12.12 I1.2 37.1,13.66 36.17,14.58 35.11,14.58 | v32.69,10.54 32.69,10.52 32.28,10.11 32.28,8.97 | C17.1 29.38,9.62 30.03,8.96 31.44,8.96 31.44,8.97 32.28,8.97 | C17.1 25.91,9.62 25.67,9.86 23.95,9.86 23.21,9.11 22.69,9.11 22.33,9.47 22.33,10.79 20.52,12.6 v20.52,13.29 | v34.2,14.64 35.04,14.64 C5.1 35.11,14.58 | C6.1 35.11,14.58
VDD3V0  (via drill 0.33, 0.35)
  Top 0.152: 33.08,19.29 v33.07,19.28
  Top 0.203: SAM4S8B.18 33.08,19.29 | SAM4S8B.7 34.61,14.14 34.21,13.74 v34.21,12.52 | v30.74,10.52 30.59,10.37 SAM4S8B.58 30.59,8.48 31.12,7.95 31.12,6.99 30.99,6.86 30.99,6.29 31.48,5.79 31.48,5.17 30.4,4.09 28.54,4.09 27.35,2.89 J3.2 | v25.45,12.68 25.42,12.64 SAM4S8B.45 23.25,12.64 23.09,12.8 23.09,13.46 22.55,13.99 21.9,13.99 OV2640.14 21.01,14.09 20.86,13.93 20.24,13.93 16.82,17.36 16.82,18.65 15.45,20.02 9.85,20.02 9.42,20.45 9.42,23.11 10.08,23.77 13.95,23.77 14.58,23.14 v14.58,22.84 | C11.1 12.38,27.93 12.12,28.19 6.7,28.19 C10.1 6.12,26.73 v6.12,26.06 | v25.41,9.26 25.63,9.48 25.63,10.26 | R4.2 9.66,5.59 R5.2 9.64,7.43 v9.6,7.47 | v14.48,27.81 15.31,27.81 R6.2 | v22.51,8.41 21.9,7.81 21.9,6.18 21.75,6.04 20.54,6.04 v20.22,5.71 | OV2640.21 18.86,10.59 v18.14,9.87
  Top 0.381: C4.1 R2.2 47.7,14.17 v47.62,14.25 | R7.1 34.99,9.81 34.44,10.36 | C11.1 12.48,27.08 15.08,27.08 R6.2 | v35.51,19.53 34.65,19.53 34.37,19.25
  Bottom 0.203: v33.07,19.28 C7.1 31.48,21.77 R3.1 | v30.74,10.52 C16.1 | C1.1 35.06,12.52 v34.21,12.52 | C13.1 25.45,12.65 v25.45,12.68 | v22.51,8.41 23.02,8.41 24.05,9.43 25.23,9.43 v25.41,9.26 | v14.48,27.81 14.56,27.73 U1.10 14.56,23.87 14.61,23.82 14.58,23.8 v14.58,22.84 | U1.35 5.67,6.79 6.93,8.05 9.02,8.05 v9.6,7.47 10.23,6.84 12.28,6.84 12.65,6.47 12.65,4.42 13.03,4.05 13.55,4.05 13.93,4.42 13.93,6.47 15.44,7.99 | 15.44,7.99 17.49,7.99 19.76,5.71 v20.22,5.71 | 15.44,7.99 15.07,8.36 15.07,8.88 15.44,9.26 17.52,9.26 v18.14,9.87
  Bottom 0.381: v47.62,14.25 47.62,15.39 U$3.2 | U1.35 5.67,2.33 C9.1 | U1.3 5.67,25.61 v6.12,26.06
  Bottom 0.508: U$3.2 U$3.4 41.79,15.79 38.05,19.53 v35.51,19.53
  pour Top: 24.84,19.91 34.82,19.91 34.82,9.91 24.82,9.91 24.82,19.91
VSYNC
  Top 0.203: SAM4S8B.20 32.09,21.27 31.75,21.61 30.79,21.61 30.5,21.91 30.03,21.91 29.31,22.63 29.11,22.63 28.38,23.36 28.13,23.36 27.05,24.43 9.96,24.43 8.94,23.42 8.94,19.94 9.41,19.47 15.3,19.47 16.1,18.67 16.1,15.98 15.42,15.29 13.87,15.29 13.41,14.83 13.41,14.17 14.43,13.16 19.74,13.16 20.8,12.09 OV2640.18
XCLK  (via drill 0.33, 0.35)
  Top 0.203: OV2640.12 20.88,15.09 19.13,16.84 18.43,16.84 17.4,17.87 17.4,18.35 17.77,18.72 18.49,18.72 v18.64,18.87 | SAM4S8B.9 36.47,15.15 v37.03,15.72 | v39.42,24.05 38.81,23.44 38.81,21.57 42.56,17.82 42.56,15.61 42.41,15.46 39.8,15.46 39.26,16 v38.81,16 | v36.4,26.95 35.19,26.95 34.73,26.49 31.2,26.49 30.35,27.34 30.35,28.18 29.65,28.88 28.66,28.88 27.96,28.18 27.96,27.2 26.26,25.5 24.07,25.5 v23.83,25.74
  Bottom 0.203: v37.03,15.72 37.31,16 v38.81,16 | v39.42,24.05 36.52,26.95 v36.4,26.95 | v18.64,18.87 18.64,20.55 20.13,22.04 22.93,22.04 23.31,22.42 23.31,25.23 v23.83,25.74
XTAL1  (via drill 0.35)
  Top 0.203: 16.000MHZ-D2Y-T.1 39.3,7.82 v38.08,7.82 | v35.26,9.07 34.21,8.03 32.89,8.03 32.57,8.35 SAM4S8B.62
  Top 0.508: C18.1 40.67,8.17 16.000MHZ-D2Y-T.1
  Bottom 0.203: v38.08,7.82 36.51,7.82 v35.26,9.07
XTAL2  (via drill 0.33, 0.35)
  Top 0.203: SAM4S8B.61 32.18,9.2 32.18,8.24 32.75,7.67 34.75,7.67 36,8.91 v36.78,8.91 | v39.55,14.68 40.49,13.74 40.49,13.31
  Top 0.381: 16.000MHZ-D2Y-T.2 40.49,13.31 40.58,13.4 C19.1
  Bottom 0.203: v39.55,14.68 37.75,12.89 37.75,11.54 37.6,11.39 36.87,11.39 36.44,10.97 36.44,9.56 36.78,9.22 v36.78,8.91

### Text on the board
tPlace: Webcam / V2.0 05/01/2019 | SWO | IO | CLK | NRST | 3V0 | GND | PWM0 | 5V0 | GND